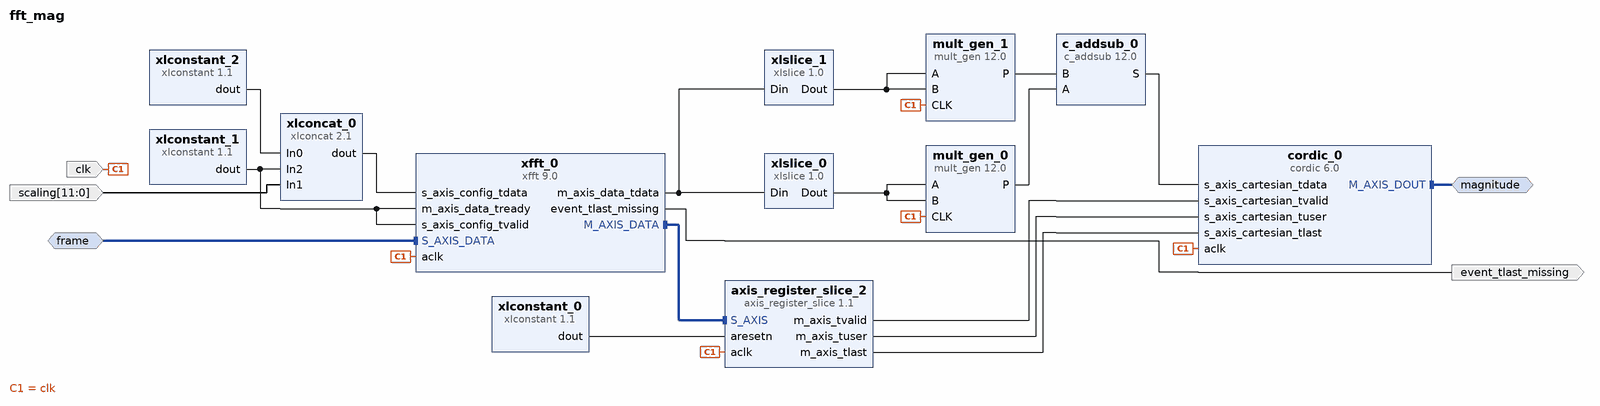
[diagram p0: block diagram of the top level]
# Vivado block design fft_mag, Vivado 2016.2
create_bd_design fft_mag

create_bd_intf_port -mode Slave -vlnv xilinx.com:interface:axis_rtl:1.0 frame
set_property -dict [list \
  CONFIG.TDATA_NUM_BYTES 4 \
  CONFIG.TDEST_WIDTH 0 \
  CONFIG.TID_WIDTH 0 \
  CONFIG.TUSER_WIDTH 0 \
  CONFIG.HAS_TREADY 1 \
  CONFIG.HAS_TSTRB 0 \
  CONFIG.HAS_TKEEP 0 \
  CONFIG.HAS_TLAST 1 \
  CONFIG.LAYERED_METADATA undef \
] [get_bd_intf_ports frame]
create_bd_intf_port -mode Master -vlnv xilinx.com:interface:axis_rtl:1.0 magnitude
set_property -dict {CONFIG.FREQ_HZ 104000000} [get_bd_intf_ports magnitude]
create_bd_port -dir I -type clk clk
set_property -dict {CONFIG.FREQ_HZ 104000000 CONFIG.ASSOCIATED_BUSIF frame:magnitude} [get_bd_ports clk]
create_bd_port -dir O -type intr event_tlast_missing
create_bd_port -dir I -from 11 -to 0 -type data scaling

create_bd_cell -type ip -vlnv xilinx.com:ip:axis_register_slice:1.1 axis_register_slice_2
set_property -dict {CONFIG.TUSER_WIDTH 12 CONFIG.HAS_TREADY 0 CONFIG.HAS_TLAST 1} [get_bd_cells axis_register_slice_2]
create_bd_cell -type ip -vlnv xilinx.com:ip:c_addsub:12.0 c_addsub_0
set_property -dict {CONFIG.Latency 0} [get_bd_cells c_addsub_0]
create_bd_cell -type ip -vlnv xilinx.com:ip:cordic:6.0 cordic_0
set_property -dict [list \
  CONFIG.Functional_Selection Square_Root \
  CONFIG.Data_Format UnsignedInteger \
  CONFIG.Input_Width 32 \
  CONFIG.Output_Width 17 \
  CONFIG.Round_Mode Nearest_Even \
  CONFIG.Coarse_Rotation false \
  CONFIG.cartesian_has_tuser true \
  CONFIG.cartesian_tuser_width 12 \
  CONFIG.cartesian_has_tlast true \
  CONFIG.out_tlast_behv Pass_Cartesian_TLAST \
] [get_bd_cells cordic_0]
create_bd_cell -type ip -vlnv xilinx.com:ip:mult_gen:12.0 mult_gen_0
set_property -dict [list \
  CONFIG.PortAWidth 16 \
  CONFIG.PortBWidth 16 \
  CONFIG.Multiplier_Construction Use_Mults \
  CONFIG.OptGoal Speed \
] [get_bd_cells mult_gen_0]
create_bd_cell -type ip -vlnv xilinx.com:ip:mult_gen:12.0 mult_gen_1
set_property -dict [list \
  CONFIG.PortAWidth 16 \
  CONFIG.PortBWidth 16 \
  CONFIG.Multiplier_Construction Use_Mults \
  CONFIG.Use_Custom_Output_Width false \
] [get_bd_cells mult_gen_1]
create_bd_cell -type ip -vlnv xilinx.com:ip:xfft:9.0 xfft_0
set_property -dict [list \
  CONFIG.transform_length 2048 \
  CONFIG.target_clock_frequency 104 \
  CONFIG.implementation_options pipelined_streaming_io \
  CONFIG.phase_factor_width 16 \
  CONFIG.scaling_options scaled \
  CONFIG.rounding_modes convergent_rounding \
  CONFIG.xk_index true \
  CONFIG.number_of_stages_using_block_ram_for_data_and_phase_factors 4 \
  CONFIG.complex_mult_type use_mults_resources \
  CONFIG.butterfly_type use_xtremedsp_slices \
] [get_bd_cells xfft_0]
create_bd_cell -type ip -vlnv xilinx.com:ip:xlconstant:1.1 xlconstant_0
set_property -dict {CONFIG.CONST_VAL 0} [get_bd_cells xlconstant_0]
create_bd_cell -type ip -vlnv xilinx.com:ip:xlconstant:1.1 xlconstant_1
set_property -dict {CONFIG.CONST_VAL 1} [get_bd_cells xlconstant_1]
create_bd_cell -type ip -vlnv xilinx.com:ip:xlconstant:1.1 xlconstant_2
set_property -dict {CONFIG.CONST_WIDTH 3 CONFIG.CONST_VAL 0} [get_bd_cells xlconstant_2]
create_bd_cell -type ip -vlnv xilinx.com:ip:xlslice:1.0 xlslice_0
set_property -dict {CONFIG.DOUT_WIDTH 16 CONFIG.DIN_TO 0 CONFIG.DIN_FROM 15 CONFIG.DIN_WIDTH 32} [get_bd_cells xlslice_0]
create_bd_cell -type ip -vlnv xilinx.com:ip:xlslice:1.0 xlslice_1
set_property -dict {CONFIG.DOUT_WIDTH 16 CONFIG.DIN_TO 16 CONFIG.DIN_FROM 31 CONFIG.DIN_WIDTH 32} [get_bd_cells xlslice_1]
create_bd_cell -type ip -vlnv xilinx.com:ip:xlconcat:2.1 xlconcat_0
set_property -dict {CONFIG.NUM_PORTS 3} [get_bd_cells xlconcat_0]

# ---- connections ----

connect_bd_intf_net [get_bd_intf_pins axis_register_slice_2/S_AXIS] [get_bd_intf_pins xfft_0/M_AXIS_DATA]
connect_bd_intf_net [get_bd_intf_ports frame] [get_bd_intf_pins xfft_0/S_AXIS_DATA]
connect_bd_intf_net [get_bd_intf_ports magnitude] [get_bd_intf_pins cordic_0/M_AXIS_DOUT]
connect_bd_net [get_bd_pins xfft_0/m_axis_data_tdata] [get_bd_pins xlslice_0/Din] [get_bd_pins xlslice_1/Din]
connect_bd_net [get_bd_pins xlslice_0/Dout] [get_bd_pins mult_gen_0/A] [get_bd_pins mult_gen_0/B]
connect_bd_net [get_bd_pins xlslice_1/Dout] [get_bd_pins mult_gen_1/A] [get_bd_pins mult_gen_1/B]
connect_bd_net [get_bd_pins mult_gen_1/P] [get_bd_pins c_addsub_0/B]
connect_bd_net [get_bd_pins mult_gen_0/P] [get_bd_pins c_addsub_0/A]
connect_bd_net [get_bd_pins c_addsub_0/S] [get_bd_pins cordic_0/s_axis_cartesian_tdata]
connect_bd_net [get_bd_ports clk] \
  [get_bd_pins axis_register_slice_2/aclk] [get_bd_pins cordic_0/aclk] [get_bd_pins mult_gen_0/CLK] \
  [get_bd_pins mult_gen_1/CLK] [get_bd_pins xfft_0/aclk]
connect_bd_net [get_bd_pins xlconstant_0/dout] [get_bd_pins axis_register_slice_2/aresetn]
connect_bd_net [get_bd_pins xfft_0/event_tlast_missing] [get_bd_ports event_tlast_missing]
connect_bd_net [get_bd_pins xlconstant_1/dout] \
  [get_bd_pins xfft_0/m_axis_data_tready] [get_bd_pins xlconcat_0/In2] [get_bd_pins xfft_0/s_axis_config_tvalid]
connect_bd_net [get_bd_pins axis_register_slice_2/m_axis_tvalid] [get_bd_pins cordic_0/s_axis_cartesian_tvalid]
connect_bd_net [get_bd_pins axis_register_slice_2/m_axis_tuser] [get_bd_pins cordic_0/s_axis_cartesian_tuser]
connect_bd_net [get_bd_pins axis_register_slice_2/m_axis_tlast] [get_bd_pins cordic_0/s_axis_cartesian_tlast]
connect_bd_net [get_bd_pins xlconcat_0/dout] [get_bd_pins xfft_0/s_axis_config_tdata]
connect_bd_net [get_bd_pins xlconstant_2/dout] [get_bd_pins xlconcat_0/In0]
connect_bd_net [get_bd_ports scaling] [get_bd_pins xlconcat_0/In1]

validate_bd_design
save_bd_design
